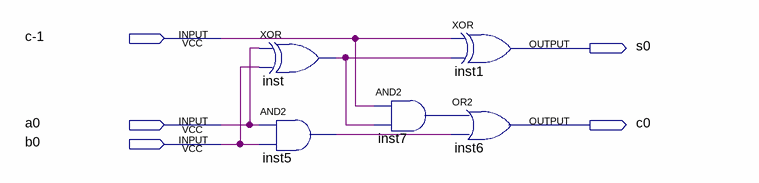
[diagram p0: schematic sheet]
// Quartus schematic test04162.bdf as structural Verilog: 5 symbols, 5 pins
module test04162 (
  input  \c-1 ,
  input  a0,
  input  b0,
  output s0,
  output c0
);

  wire inst5_out, inst7_out, inst_out;

  xor inst (inst_out, a0, b0);
  and inst5 (inst5_out, a0, b0);
  and inst7 (inst7_out, \c-1 , inst_out);
  xor inst1 (s0, \c-1 , inst_out);
  or inst6 (c0, inst7_out, inst5_out);
endmodule
